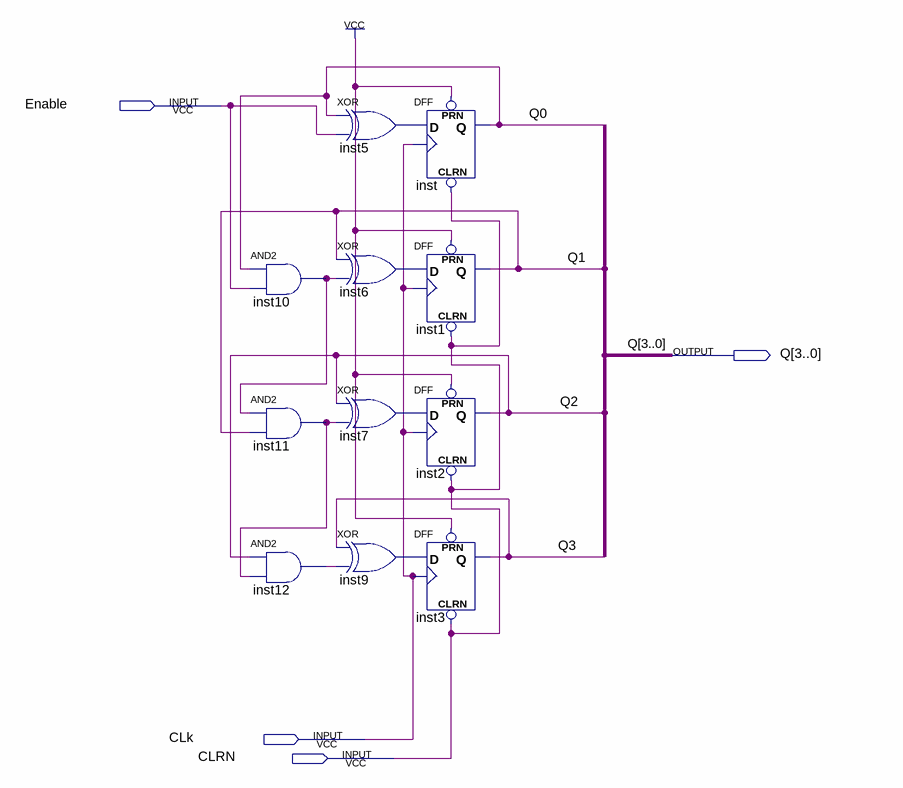
[diagram p0: schematic sheet]
// Quartus schematic lab10step2b.bdf as structural Verilog: 11 symbols, 4 pins
module lab10step2b (
  input  Enable,
  input  CLk,
  input  CLRN,
  output [3:0] Q
);

  wire inst5_out, inst6_out, inst7_out, inst9_out, inst10_out, inst11_out, inst12_out;

  and inst10 (inst10_out, Q[0], Enable);
  and inst11 (inst11_out, inst10_out, Q[1]);
  and inst12 (inst12_out, Q[2], inst11_out);
  xor inst5 (inst5_out, Q[0], Enable);
  xor inst6 (inst6_out, Q[1], inst10_out);
  xor inst7 (inst7_out, Q[2], inst11_out);
  xor inst9 (inst9_out, Q[3], inst12_out);
  DFF inst (.CLRN(CLRN), .CLK(CLk), .D(inst5_out), .PRN(1'b1), .Q(Q[0]));
  DFF inst1 (.CLRN(CLRN), .CLK(CLk), .D(inst6_out), .PRN(1'b1), .Q(Q[1]));
  DFF inst2 (.CLRN(CLRN), .CLK(CLk), .D(inst7_out), .PRN(1'b1), .Q(Q[2]));
  DFF inst3 (.CLRN(CLRN), .CLK(CLk), .D(inst9_out), .PRN(1'b1), .Q(Q[3]));
endmodule
